# EAGLE design 7SEG_4DIGIT_1 (EAGLE 6.5.0)

## Sheet 1 of 2
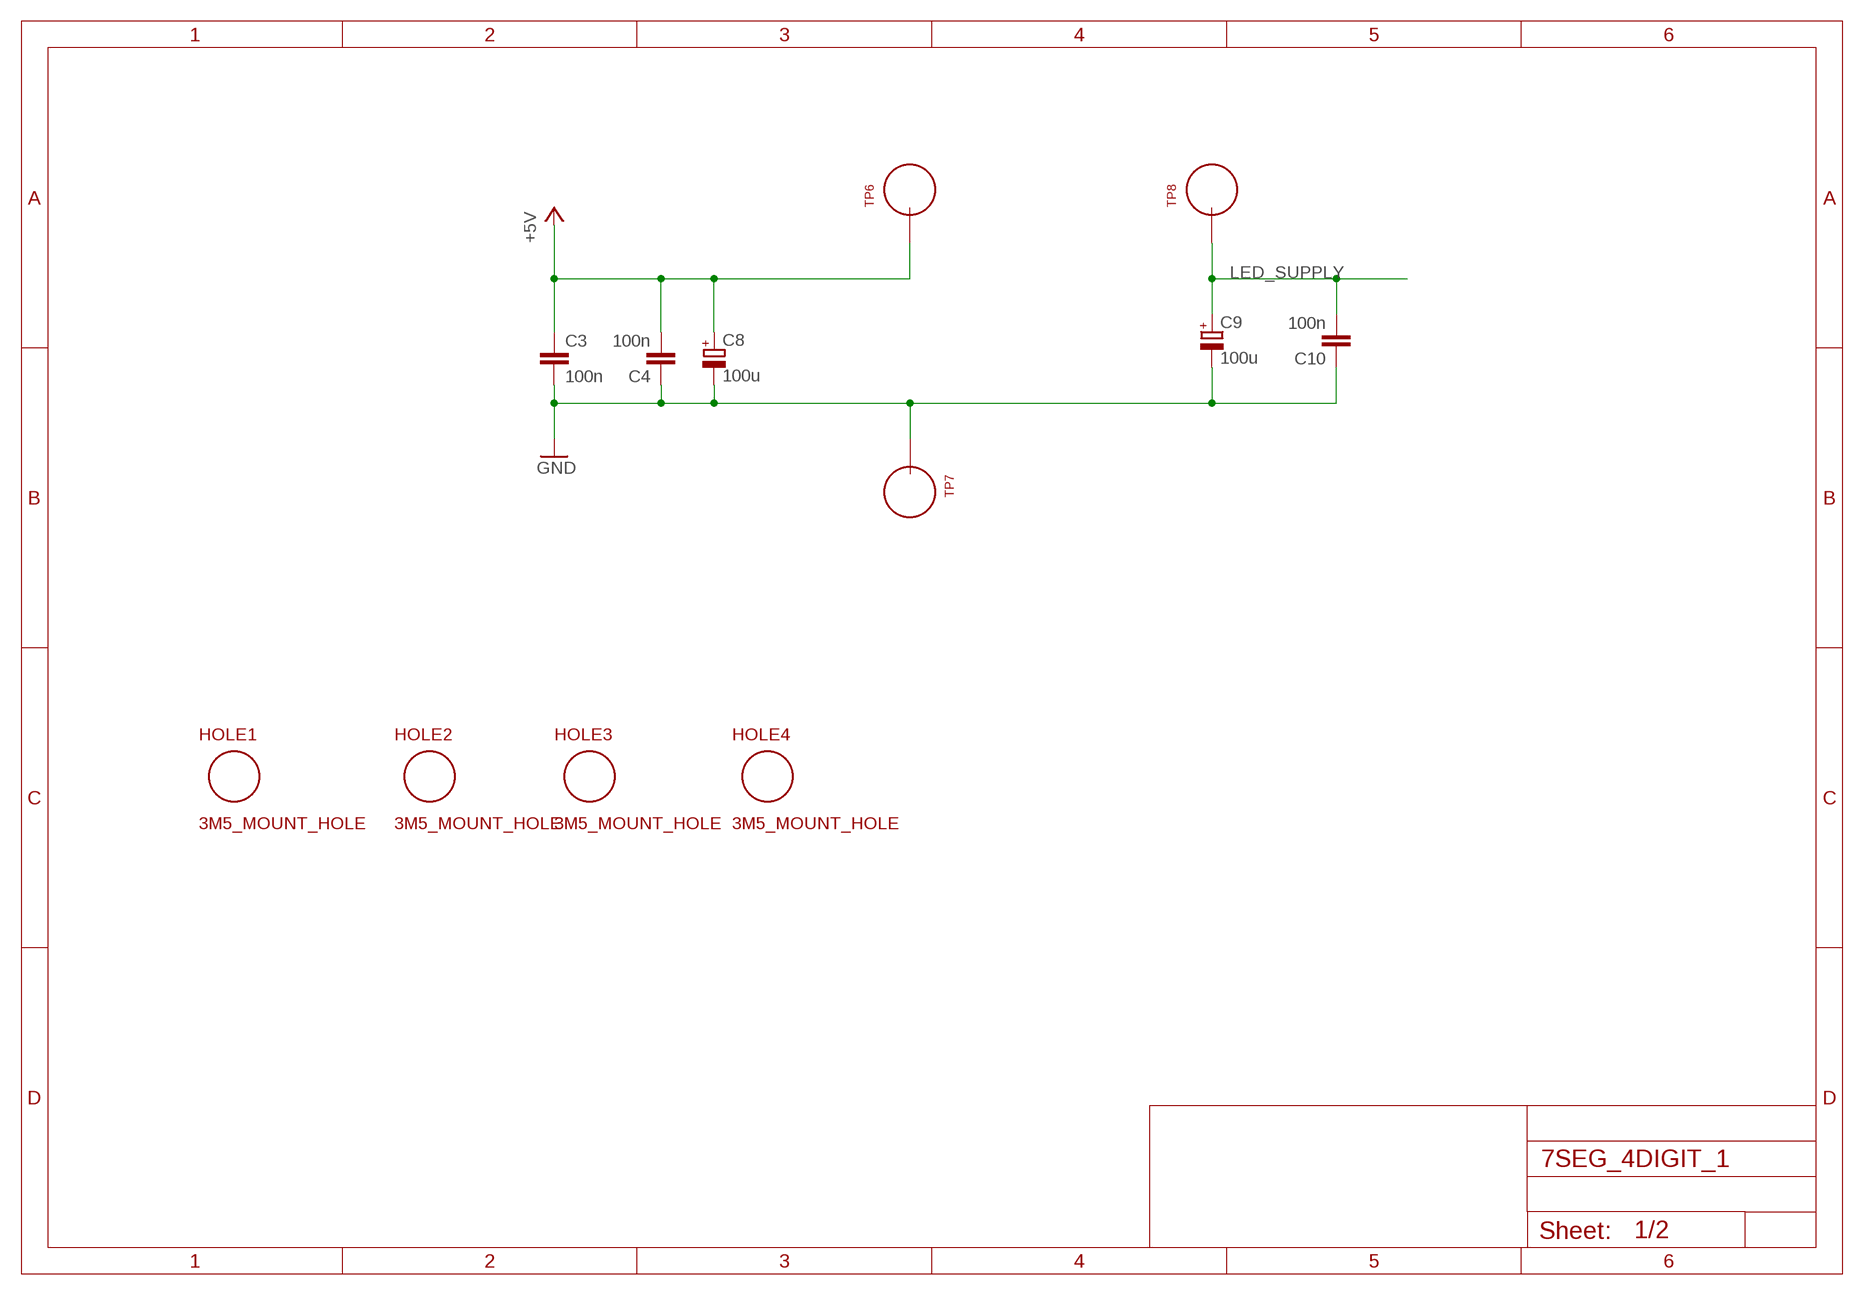
[diagram p0: schematic, sheet 1]

### Parts
C3  100n  C_P2INCH  [CAP_P2INCH]
C4  100n  C_P2INCH  [CAP_P2INCH]
C8  100u  POLARISED_CAP_2P5_6P3MM  [POLARISED_CAP_2P5_6P3MM]
C9  100u  POLARISED_CAP_2P5_6P3MM  [POLARISED_CAP_2P5_6P3MM]
C10  100n  C_P2INCH  [CAP_P2INCH]
HOLE1  3M5_MOUNT_HOLE  [3P5M_HOLE]
HOLE2  3M5_MOUNT_HOLE  [3P5M_HOLE]
HOLE3  3M5_MOUNT_HOLE  [3P5M_HOLE]
HOLE4  3M5_MOUNT_HOLE  [3P5M_HOLE]
TP6  TEST_LOOP  [TEST_LOOP]
TP7  TEST_LOOP  [TEST_LOOP]
TP8  TEST_LOOP  [TEST_LOOP]

### Nets
+5V: C3.1 C4.2 C8.A TP6.P$1 ; also sheet 2
GND: C3.2 C4.1 C8.K C9.K C10.1 TP7.P$1 ; also sheet 2
LED_SUPPLY: C9.A C10.2 TP8.P$1 ; also sheet 2

## Sheet 2 of 2
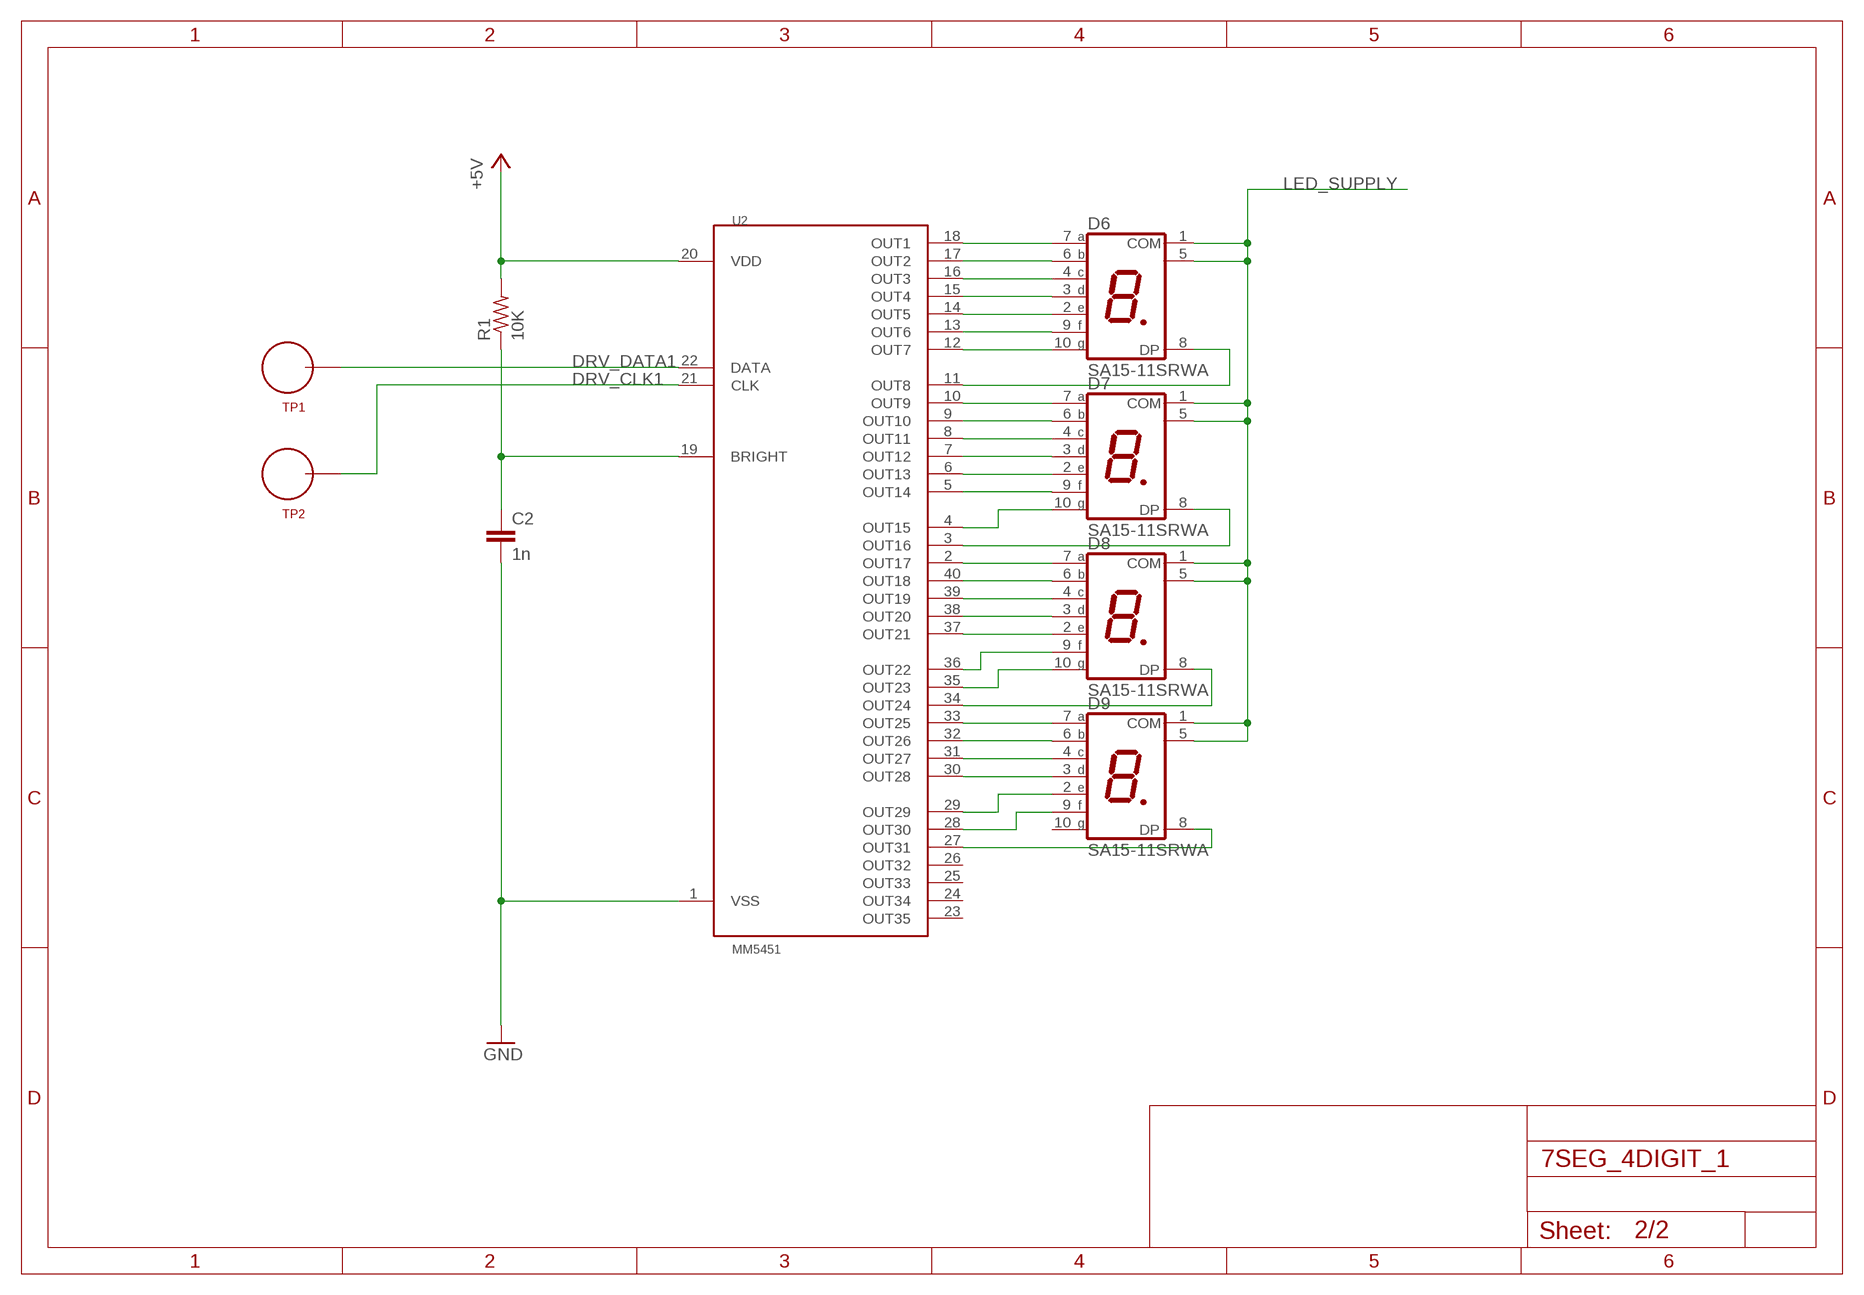
[diagram p1: schematic, sheet 2]

### Parts
C2  1n  C_P2INCH  [CAP_P2INCH]
D6  SA15-11SRWA  [SC15]
D7  SA15-11SRWA  [SC15]
D8  SA15-11SRWA  [SC15]
D9  SA15-11SRWA  [SC15]
R1  10K  R_P2INCH  [R_P2INCH]
TP1  TEST_LOOP  [TEST_LOOP]
TP2  TEST_LOOP  [TEST_LOOP]
U2  MM5451  [DIP40_P6]

### Nets
+5V: R1.2 U2.20(VDD) ; also sheet 1
DRV_CLK1: TP2.P$1 U2.21(CLK)
DRV_DATA1: TP1.P$1 U2.22(DATA)
GND: C2.2 U2.1(VSS) ; also sheet 1
LED_SUPPLY: D6.1(COM) D6.5(COM) D7.1(COM) D7.5(COM) D8.1(COM) D8.5(COM) D9.1(COM) D9.5(COM) ; also sheet 1
N$1: D6.8(DP) U2.11(OUT8)
N$2: D7.7(A) U2.10(OUT9)
N$3: D7.6(B) U2.9(OUT10)
N$40: C2.1 R1.1 U2.19(BRIGHT)
N$42: D7.4(C) U2.8(OUT11)
N$43: D7.3(D) U2.7(OUT12)
N$44: D7.2(E) U2.6(OUT13)
N$46: D7.9(F) U2.5(OUT14)
N$47: D7.10(G) U2.4(OUT15)
N$48: D6.7(A) U2.18(OUT1)
N$49: D6.6(B) U2.17(OUT2)
N$50: D6.4(C) U2.16(OUT3)
N$51: D6.3(D) U2.15(OUT4)
N$52: D6.2(E) U2.14(OUT5)
N$53: D6.9(F) U2.13(OUT6)
N$54: D6.10(G) U2.12(OUT7)
N$55: D7.8(DP) U2.3(OUT16)
N$56: D8.7(A) U2.2(OUT17)
N$57: D8.6(B) U2.40(OUT18)
N$58: D8.4(C) U2.39(OUT19)
N$59: D8.3(D) U2.38(OUT20)
N$60: D8.2(E) U2.37(OUT21)
N$61: D8.9(F) U2.36(OUT22)
N$62: D8.10(G) U2.35(OUT23)
N$63: D8.8(DP) U2.34(OUT24)
N$64: D9.7(A) U2.33(OUT25)
N$65: D9.6(B) U2.32(OUT26)
N$66: D9.4(C) U2.31(OUT27)
N$67: D9.3(D) U2.30(OUT28)
N$68: D9.2(E) U2.29(OUT29)
N$69: D9.9(F) U2.28(OUT30)
N$70: D9.8(DP) U2.27(OUT31)
Unconnected: D9.10(G) U2.23(OUT35) U2.24(OUT34) U2.25(OUT33) U2.26(OUT32)

## Library data of the parts
C2-C4 C10 = MyLib:C_P2INCH
C8 C9 = MyLib:POLARISED_CAP_2P5_6P3MM
D6-D9 = MyLib:SA15-11SRWA
HOLE1-HOLE4 = MyLib:3M5_MOUNT_HOLE
R1 = MyLib:R_P2INCH
TP1 TP2 TP6-TP8 = MyLib:TEST_LOOP
U2 = MyLib:MM5451

## Board
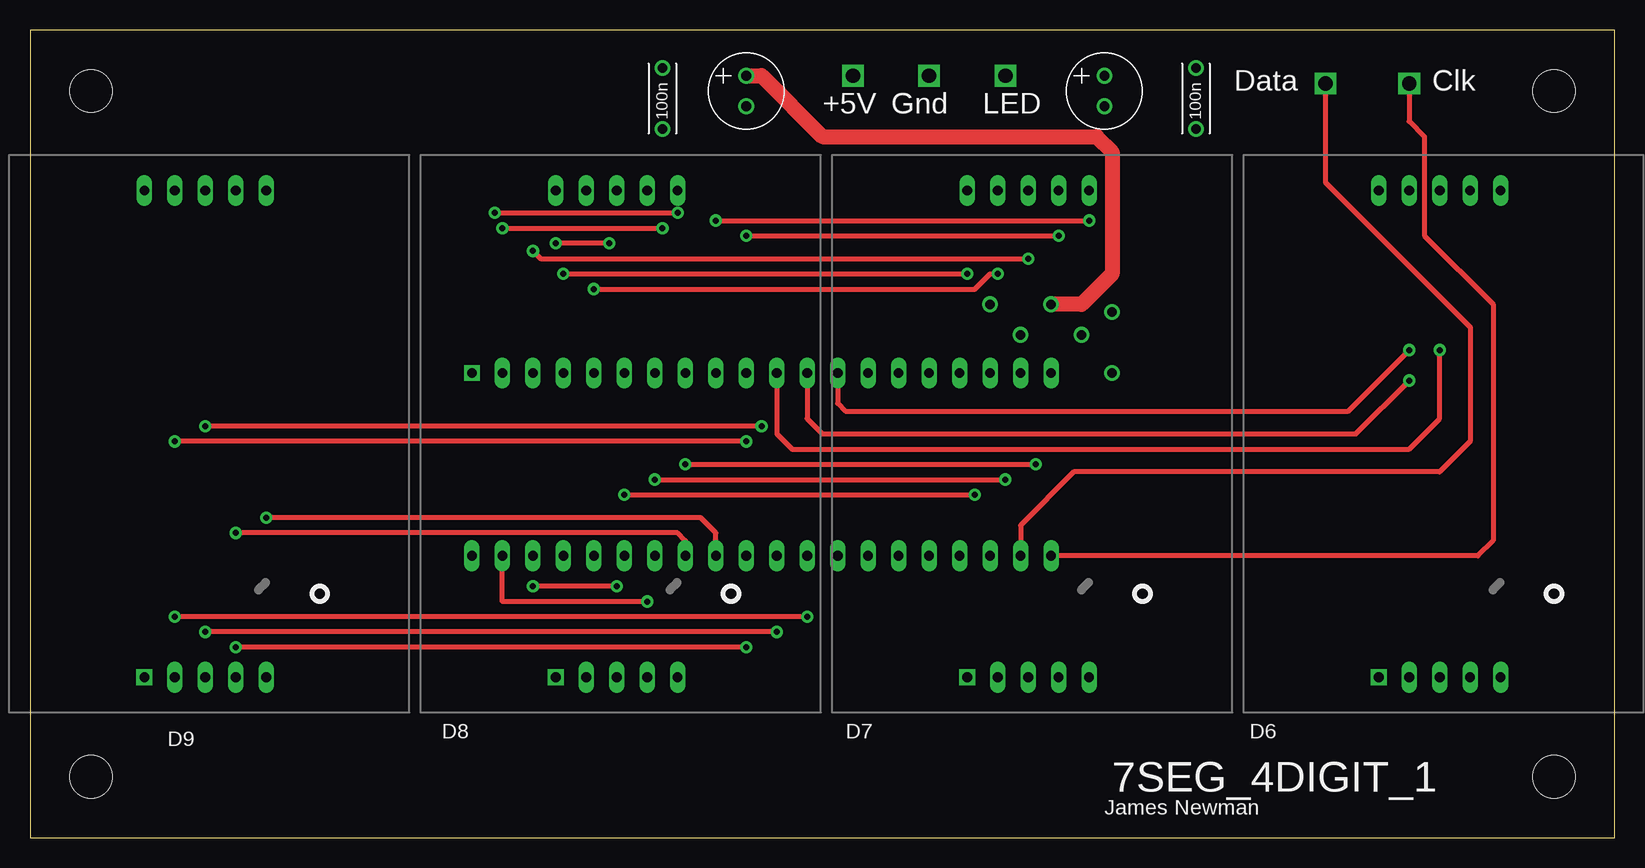
[diagram p2: board, top side]
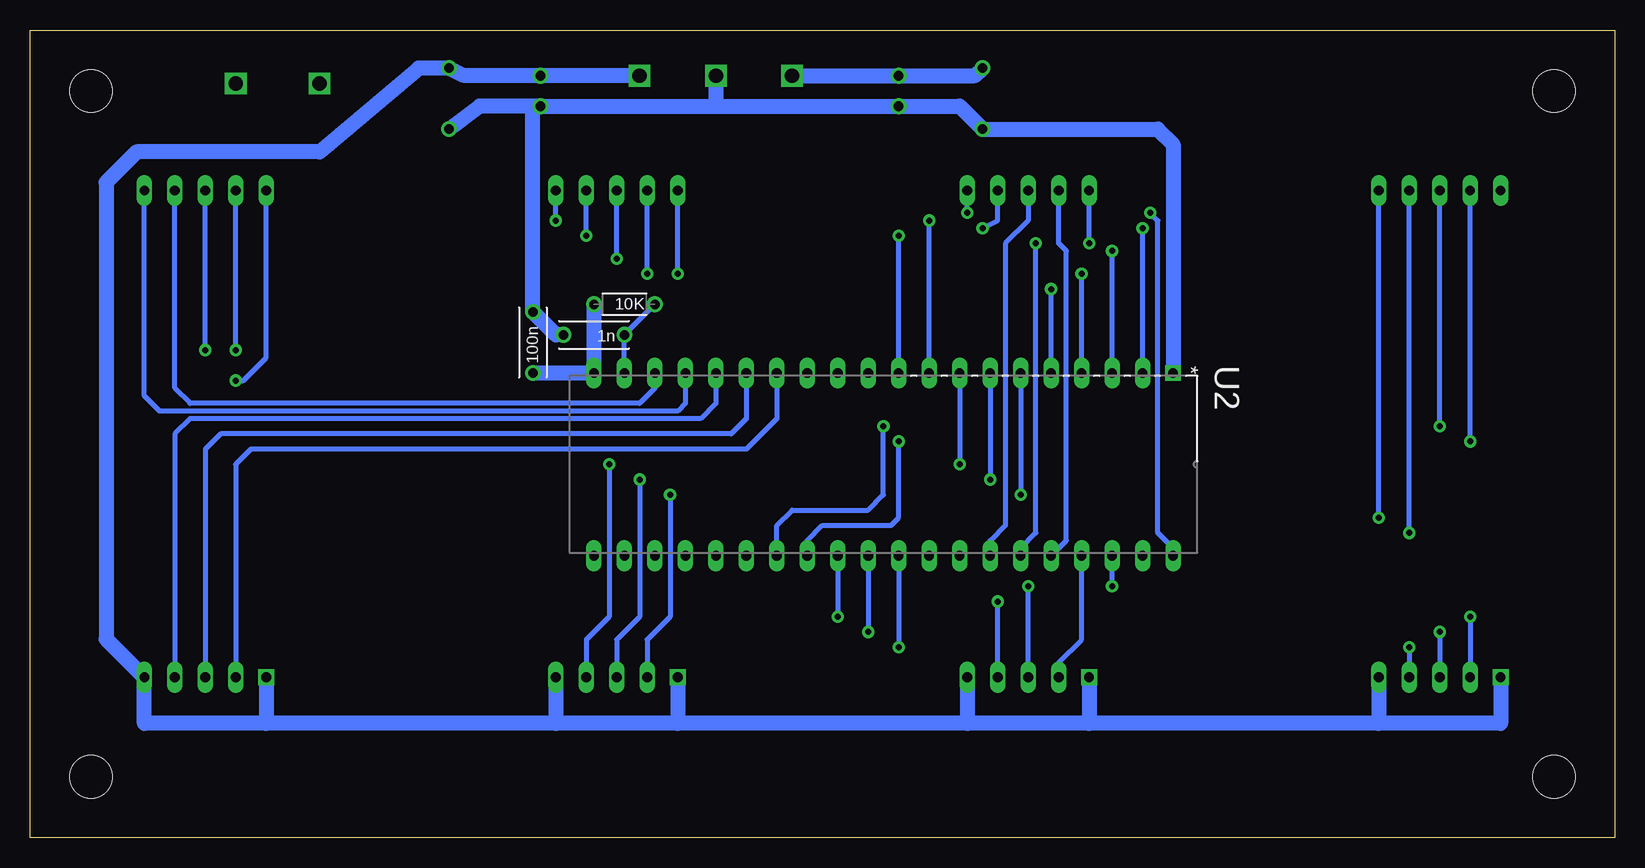
[diagram p3: board, bottom side, seen from below]

Size 132.08 x 67.31 mm. Coordinates in mm from the lower left corner, seen from the top.
Outline: 0,0 132.08,0 132.08,67.31 0,67.31 0,0
Copper layers (1*16): Top 0.035mm / dielectric 1.5mm / Bottom 0.035mm
Design rules "processor_rules_2layer": minimum track width 8mil, minimum drill 14mil, track to track 8mil, track to pad 8mil, pad to pad 8mil, via to via 8mil, smd to smd 8mil, copper to edge 40mil, drill to drill 8mil, minimum pad ring 10mil, minimum via ring 8mil, stop-mask expansion 4mil, vias tented up to drill 0.7mm, thermal gap 10mil

### Footprints (pad centres in the part's own frame; a part is rotated, then mirrored left to right if it is on the bottom)
CAP_P2INCH = drill 0.8: 1 -2.54,0; 2 2.54,0
POLARISED_CAP_2P5_6P3MM = drill 0.8: A 1.27,0; K -1.27,0
SC15 = drill 0.8 square: 1 11.43,3.215 | drill 0.8 long: 2 13.97,3.215; 3 16.51,3.215; 4 19.05,3.215; 5 21.59,3.215; 6 21.59,43.775; 7 19.05,43.775; 8 16.51,43.775; 9 13.97,43.775; 10 11.43,43.775
3P5M_HOLE = hole 3.556: 0,0
R_P2INCH = drill 0.8: 1 -2.54,0; 2 2.54,0
TEST_LOOP = drill 1.2 square: P$1 0,0
DIP40_P6 = drill 0.8 square: 1 -7.62,24.13 | drill 0.8 long: 2 -7.62,21.59; 3 -7.62,19.05; 4 -7.62,16.51; 5 -7.62,13.97; 6 -7.62,11.43; 7 -7.62,8.89; 8 -7.62,6.35; 9 -7.62,3.81; 10 -7.62,1.27; 11 -7.62,-1.27; 12 -7.62,-3.81; 13 -7.62,-6.35; 14 -7.62,-8.89; 15 -7.62,-11.43; 16 -7.62,-13.97; 17 -7.62,-16.51; 18 -7.62,-19.05; 19 -7.62,-21.59; 20 -7.62,-24.13; 21 7.62,-24.13; 22 7.62,-21.59; 23 7.62,-19.05; 24 7.62,-16.51; 25 7.62,-13.97; 26 7.62,-11.43; 27 7.62,-8.89; 28 7.62,-6.35; 29 7.62,-3.81; 30 7.62,-1.27; 31 7.62,1.27; 32 7.62,3.81; 33 7.62,6.35; 34 7.62,8.89; 35 7.62,11.43; 36 7.62,13.97; 37 7.62,16.51; 38 7.62,19.05; 39 7.62,21.59; 40 7.62,24.13

### Placement (x,y rotation side)
C2  85.09,41.91 180 bottom
C3  90.17,41.27 90 bottom
C4  52.7,61.59 90 top
C8  59.69,62.23 90 top
C9  89.53,62.23 90 top
C10  97.16,61.59 90 top
D6  100.97,10.16 0 top
D7  66.67,10.16 0 top
D8  32.38,10.16 0 top
D9  -1.91,10.16 0 top
HOLE1  5.08,62.23 0 top
HOLE2  5.08,5.08 0 top
HOLE3  127,62.23 0 top
HOLE4  127,5.08 0 top
R1  82.55,44.45 180 bottom
TP1  107.95,62.87 0 top
TP2  114.94,62.87 0 top
TP6  68.58,63.5 90 top
TP7  74.93,63.5 90 top
TP8  81.28,63.5 90 top
U2  60.96,31.11 270 bottom

### Tracks (layer width: path | path; a pad name or v marks a point on that pad's centre or on a via)
+5V
  Top 1.27: C8.A 60.96,63.5 66.04,58.42 88.9,58.42 90.17,57.15 90.17,46.99 87.63,44.45 R1.2
  Bottom 1.27: TP6.P$1 C8.A 53.34,63.5 C4.2 | C3.1 U2.20 R1.2
DRV_CLK1
  Top 0.406: TP2.P$1 114.94,59.69 116.2,58.42 116.2,50.16 121.92,44.45 121.92,24.77 120.65,23.5 U2.21
DRV_DATA1
  Top 0.406: TP1.P$1 107.95,54.61 120.02,42.55 120.02,33.02 117.47,30.48 87,30.48 82.55,26.04 U2.22
GND
  Bottom 1.27: 90.17,60.96 C9.K 74.93,60.96 | 90.17,60.96 94.61,60.96 C10.1 | 74.93,60.96 C8.K 54.61,60.96 C4.1 38.1,59.05 36.83,57.78 U2.1 | TP7.P$1 74.93,60.96 | 90.17,60.96 C3.2 88.27,41.91 C2.2
LED_SUPPLY
  Bottom 1.27: D9.1 9.53,9.53 19.68,9.53 | 19.68,9.53 43.81,9.53 | 43.81,9.53 53.98,9.53 | 53.98,9.53 78.11,9.53 | 78.11,9.53 88.27,9.53 | 88.27,9.53 112.39,9.53 | 112.39,9.53 122.56,9.53 D6.5 125.73,16.55 125.73,54.61 123.19,57.15 107.95,57.15 99.69,64.14 C10.2 95.89,63.5 C9.A TP8.P$1 | D6.1 112.39,9.53 | D7.5 88.27,9.53 | D7.1 78.11,9.53 | D9.5 19.68,9.53 | D8.1 43.81,9.53 | D8.5 53.98,9.53
N$1  (via drill 0.5 pad 1.02)
  Top 0.406: U2.11 62.23,33.66 63.5,32.38 114.94,32.38 117.47,34.92 v117.47,40.64
  Bottom 0.406: v117.47,40.64 D6.8
N$2  (via drill 0.5 pad 1.02)
  Top 0.406: v59.69,50.16 v85.72,50.16
  Bottom 0.406: U2.10 v59.69,50.16 | v85.72,50.16 D7.7
N$3  (via drill 0.5 pad 1.02)
  Top 0.406: v57.15,51.44 v88.27,51.44
  Bottom 0.406: U2.9 v57.15,51.44 | v88.27,51.44 D7.6
N$40
  Bottom 0.406: U2.19 C2.1 R1.1
N$42  (via drill 0.5 pad 1.02)
  Top 0.406: v54.61,31.11 v83.82,31.11
  Bottom 0.406: U2.8 v54.61,31.11 | v83.82,31.11 83.82,18.41 85.72,16.51 D7.4
N$43  (via drill 0.5 pad 1.02)
  Top 0.406: v52.07,29.84 v81.28,29.84
  Bottom 0.406: U2.7 v52.07,29.84 | v81.28,29.84 81.28,18.41 83.19,16.51 D7.3
N$44  (via drill 0.5 pad 1.02)
  Top 0.406: v49.53,28.57 v78.74,28.57
  Bottom 0.406: U2.6 v49.53,28.57 | v78.74,28.57 78.74,18.41 80.64,16.51 D7.2
N$46  (via drill 0.5 pad 1.02)
  Top 0.406: v46.99,45.72 78.74,45.72 80.01,46.99 v80.64,46.99
  Bottom 0.406: U2.5 v46.99,45.72 | v80.64,46.99 D7.9
N$47  (via drill 0.5 pad 1.02)
  Top 0.406: v44.45,46.99 v78.11,46.99
  Bottom 0.406: U2.4 v44.45,46.99 | v78.11,46.99 D7.10
N$48
  Bottom 0.406: U2.18 80.01,37.47 81.28,36.2 118.75,36.2 120.02,37.47 D6.7
N$49
  Bottom 0.406: U2.17 77.47,36.2 78.11,35.56 121.28,35.56 122.56,36.83 D6.6
N$50
  Bottom 0.406: U2.16 74.93,36.2 76.2,34.92 118.75,34.92 120.02,33.66 D6.4
N$51
  Bottom 0.406: U2.15 72.39,34.92 73.66,33.66 116.2,33.66 117.47,32.38 D6.3
N$52
  Bottom 0.406: U2.14 69.85,34.92 72.39,32.38 113.67,32.38 114.94,31.11 D6.2
N$53  (via drill 0.5 pad 1.02)
  Top 0.406: U2.13 67.31,36.2 67.94,35.56 109.86,35.56 v114.94,40.64
  Bottom 0.406: v114.94,40.64 D6.9
N$54  (via drill 0.5 pad 1.02)
  Top 0.406: U2.12 64.77,34.92 66.04,33.66 110.49,33.66 v114.94,38.1
  Bottom 0.406: v114.94,38.1 114.3,38.1 112.39,40.01 D6.10
N$55  (via drill 0.5 pad 1.02)
  Top 0.406: v41.91,48.9 42.55,48.26 v83.19,48.26
  Bottom 0.406: U2.3 v41.91,48.9 | v83.19,48.26 D7.8
N$56  (via drill 0.5 pad 1.02)
  Top 0.406: v39.37,50.8 v52.7,50.8
  Bottom 0.406: U2.2 v39.37,50.8 | v52.7,50.8 51.44,51.44 D8.7
N$57  (via drill 0.5 pad 1.02)
  Top 0.406: v38.73,52.07 v53.98,52.07
  Bottom 0.406: U2.40 36.83,24.13 38.1,25.4 38.1,51.44 v38.73,52.07 | v53.98,52.07 D8.6
N$58  (via drill 0.5 pad 1.02)
  Top 0.406: v51.44,19.68 39.37,19.68 U2.39
  Bottom 0.406: D8.4 v51.44,19.68
N$59  (via drill 0.5 pad 1.02)
  Top 0.406: v48.9,20.95 v41.91,20.95
  Bottom 0.406: D8.3 v48.9,20.95 | v41.91,20.95 U2.38
N$60
  Bottom 0.406: D8.2 46.35,14.61 44.45,16.51 U2.37
N$61
  Bottom 0.406: U2.36 45.72,24.77 45.72,48.9 46.35,49.53 D8.9
N$62  (via drill 0.5 pad 1.02)
  Top 0.406: v48.26,49.53 v43.81,49.53
  Bottom 0.406: U2.35 49.53,24.13 48.26,25.4 v48.26,49.53 | v43.81,49.53 D8.10
N$63
  Bottom 0.406: D8.8 48.9,51.44 50.8,49.53 50.8,26.04 52.07,24.77 U2.34
N$64  (via drill 0.5 pad 1.02)
  Top 0.406: U2.33 54.61,24.77 53.98,25.4 v17.14,25.4
  Bottom 0.406: v17.14,25.4 D9.7
N$65  (via drill 0.5 pad 1.02)
  Top 0.406: U2.32 57.15,25.4 55.88,26.67 v19.68,26.67
  Bottom 0.406: v19.68,26.67 D9.6
N$66  (via drill 0.5 pad 1.02)
  Top 0.406: v59.69,15.88 v17.14,15.88
  Bottom 0.406: U2.31 v59.69,15.88 | v17.14,15.88 D9.4
N$67  (via drill 0.5 pad 1.02)
  Top 0.406: v62.23,17.14 v14.61,17.14
  Bottom 0.406: U2.30 v62.23,17.14 | v14.61,17.14 D9.3
N$68  (via drill 0.5 pad 1.02)
  Top 0.406: v64.77,18.41 v12.06,18.41
  Bottom 0.406: U2.29 v64.77,18.41 | v12.06,18.41 D9.2
N$69  (via drill 0.5 pad 1.02)
  Top 0.406: v59.69,33.02 v12.06,33.02
  Bottom 0.406: U2.28 67.31,24.77 66.04,26.04 60.33,26.04 59.69,26.67 v59.69,33.02 | v12.06,33.02 D9.9
N$70  (via drill 0.5 pad 1.02)
  Top 0.406: v60.96,34.29 v14.61,34.29
  Bottom 0.406: U2.27 69.85,26.04 68.58,27.3 62.23,27.3 60.96,28.57 v60.96,34.29 | v14.61,34.29 D9.8

### Text on the board
tPlace: Data | Clk | +5V | Gnd | LED | 7SEG_4DIGIT_1 | James Newman